# Altium schematic sheet MCU_144_POWER_Clone.SchDoc: MCU 144 POWER
size A4; Date: Not used; ApprovedBy: Not used; CheckedBy: Not used; Author: Not used; CompanyName: STMicroelectronics; DrawnBy: Not used; Engineer: Not used; Organization: Not used; Address1: Not used; Address2: Not used; Address3: Not used; Address4: Not used; DocumentNumber: 4; Revision: Not used; SheetNumber: 4; SheetTotal: 9; CurrentTime: Not used; CurrentDate: Not used; Time: Not used; DocumentFullPathAndName: Not used; DocumentName: Not used; ModifiedDate: Not used; ImagePath: Not used; ProjectName: Not used; Application_BuildNumber: Not used
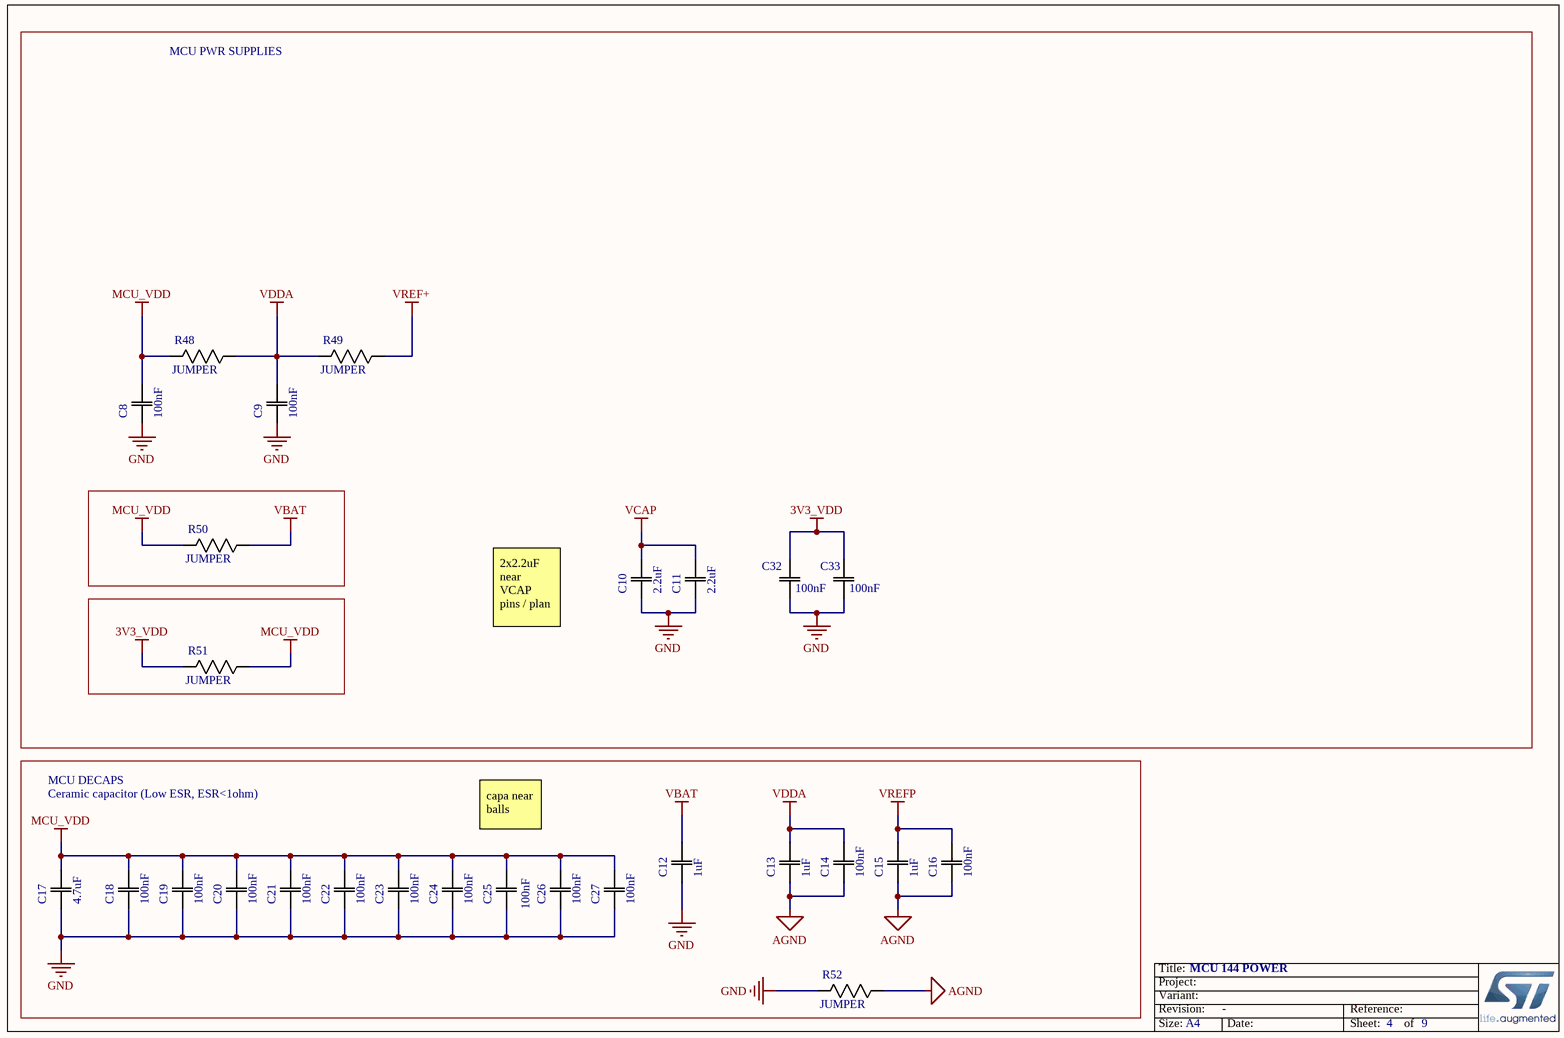
[diagram p0: MCU_144_POWER_Clone.SchDoc]

## Parts
C8  100nF  [0805]
C9  100nF  [0805]
C10  2.2uF  [0805]
C11  2.2uF  [0805]
C12  1uF  [0805]
C13  1uF  [0805]
C14  100nF  [0805]
C15  1uF  [0805]
C16  100nF  [0805]
C17  4.7uF  [0805]
C18  100nF  [0805]
C19  100nF  [0805]
C20  100nF  [0805]
C21  100nF  [0805]
C22  100nF  [0805]
C23  100nF  [0805]
C24  100nF  [0805]
C25  100nF  [0805]
C26  100nF  [0805]
C27  100nF  [0805]
C32  100nF  [0805]
C33  100nF  [0805]
R48  JUMPER  [0805]
R49  JUMPER  [0805]
R50  JUMPER  [0805]
R51  JUMPER  [0805]
R52  JUMPER  [0805]

## Blocks framed on the sheet
MCU PWR SUPPLIES: C8-C11 C32 C33 R48-R51

## Nets
3V3_VDD: C32.2(C2) C33.2(C2) R51.2(R2)
AGND: C13.1(C1) C14.1(C1) C15.1(C1) C16.1(C1) R52.1(R1)
GND: C8.1(C1) C9.1(C1) C10.1(C1) C11.1(C1) C12.1(C1) C17.1(C1) C18.1(C1) C19.1(C1) C20.1(C1) C21.1(C1) C22.1(C1) C23.1(C1) C24.1(C1) C25.1(C1) C26.1(C1) C27.1(C1) C32.1(C1) C33.1(C1) R52.2(R2)
MCU_VDD: C8.2(C2) C17.2(C2) C18.2(C2) C19.2(C2) C20.2(C2) C21.2(C2) C22.2(C2) C23.2(C2) C24.2(C2) C25.2(C2) C26.2(C2) C27.2(C2) R48.2(R2) R50.2(R2) R51.1(R1)
VBAT: C12.2(C2) R50.1(R1)
VCAP: C10.2(C2) C11.2(C2)
VDDA: C9.2(C2) C13.2(C2) C14.2(C2) R48.1(R1) R49.2(R2)
VREF+: R49.1(R1)
VREFP: C15.2(C2) C16.2(C2)

## Notes on the sheet
- 2x2.2uF near VCAP pins / plan
- MCU DECAPS
- Ceramic capacitor (Low ESR, ESR<1ohm)
- capa near balls
- Title:
- Project:
- Size:
- Revision:
- Variant:
- A4
- -
- Date:
- Reference:
- Sheet:
- of

## Library data of the parts
C8 C9 C14 C16 C18-C27 C32 C33 = CAP 100nF 0805: CAP CER 0.1UF 50V X7R 0805; MP: CC0805KRX7R9BB104; MF: Yageo; Tolerance: 10%; Package: 0805; Price: 0,119 CAD; Value: 100nF; Digikey: 311-1140-1-ND; Digikey Link: https://www.digikey.ca/products/en?keywords=311-1140-1-ND; Rating: 50V
C10 C11 = CAP 2.2uF 0805: CAP CER 1UF 50V X7R 0805; MP: C0805C225K4RACTU; MF: KEMET; Tolerance: 10%; Rating: 16V; Package: 0805; Price: 0,461 CAD; Value: 2.2uF; Digikey: 399-3523-1-ND; Digikey Link: https://www.digikey.ca/products/en?keywords=399-3523-1-ND
C12 C13 C15 = CAP 1uF 0805: CAP CER 1UF 50V X7R 0805; MP: CL21B105KBFNNNE; MF: Samsung Electro-Mechanics; Tolerance: 10%; Package: 0805; Price: 0,172 CAD; Value: 1uF; Digikey: 1276-1029-1-ND; Digikey Link: https://www.digikey.ca/product-detail/en/samsung-electro-mechanics/CL21B105KBFNNNE/1276-1029-1-ND/3889115; Rating: 50V
C17 = CAP 4.7uF 0805: CAP CER 4.7UF 25V X5R 0805; MP: CL21B475KOFNNNE; MF: Samsung Electro-Mechanics; Tolerance: 10%; Rating: 16V; Temperature Coefficient: X7R; Package: 0805; Price: 0,49 CAD; Value: 4.7uF; Digikey: 1276-2873-1-ND; Digikey Link: https://www.digikey.ca/product-detail/en/samsung-electro-mechanics/CL21B475KOFNNNE/1276-2873-1-ND/3890959
R48-R52 = RES 0 0805: RES SMD 0 OHM JUMPER 1/8W 0805; MP: RC0805JR-070RL; MF: Yageo; Value: 0; Rating: 0.125W; Digikey: 311-0.0ARCT-ND; Price: 0.058 CAD; Package: 0805; Digikey Link: https://www.digikey.ca/products/en?keywords=311-0.0ARCT-ND